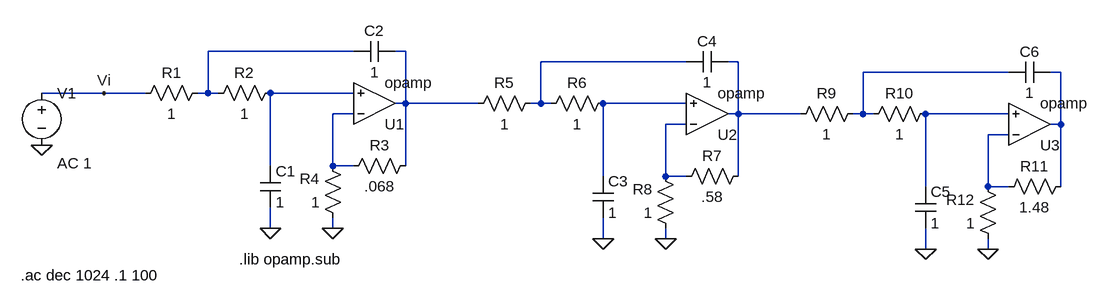
[diagram p0: schematic EJ3-TP2.asc]
EJ3-TP2.asc, the LTspice schematic file:
Version 4
SHEET 1 1192 680
WIRE 96 16 -128 16
WIRE 176 16 160 16
WIRE 608 32 384 32
WIRE 688 32 672 32
WIRE 1104 48 880 48
WIRE 1184 48 1168 48
WIRE -288 80 -384 80
WIRE -224 80 -288 80
WIRE -128 80 -128 16
WIRE -128 80 -144 80
WIRE -112 80 -128 80
WIRE 96 80 -32 80
WIRE 176 96 176 16
WIRE 176 96 160 96
WIRE 288 96 176 96
WIRE 384 96 384 32
WIRE 384 96 368 96
WIRE 400 96 384 96
WIRE 608 96 480 96
WIRE 96 112 64 112
WIRE 688 112 688 32
WIRE 688 112 672 112
WIRE 784 112 688 112
WIRE 880 112 880 48
WIRE 880 112 864 112
WIRE 896 112 880 112
WIRE 1104 112 976 112
WIRE 608 128 576 128
WIRE 1184 128 1184 48
WIRE 1184 128 1168 128
WIRE 1104 144 1072 144
WIRE -32 192 -32 80
WIRE 64 192 64 112
WIRE 96 192 64 192
WIRE 176 192 176 96
WIRE 480 208 480 96
WIRE 576 208 576 128
WIRE 608 208 576 208
WIRE 688 208 688 112
WIRE 976 224 976 112
WIRE 1072 224 1072 144
WIRE 1104 224 1072 224
WIRE 1184 224 1184 128
WIRE -32 288 -32 256
WIRE 64 288 64 272
WIRE 480 304 480 272
WIRE 576 304 576 288
WIRE 976 320 976 288
WIRE 1072 320 1072 304
FLAG -32 288 0
FLAG 64 288 0
FLAG 480 304 0
FLAG 576 304 0
FLAG 976 320 0
FLAG 1072 320 0
FLAG -384 160 0
FLAG -288 80 Vi
SYMBOL OpAmps\\opamp 128 160 M180
SYMATTR InstName U1
SYMATTR SpiceLine Aol=1000K
SYMATTR SpiceLine2 GBW=1000Meg
SYMBOL res -128 64 R90
WINDOW 0 0 56 VBottom 2
WINDOW 3 32 56 VTop 2
SYMATTR InstName R1
SYMATTR Value 1
SYMBOL res -16 64 R90
WINDOW 0 0 56 VBottom 2
WINDOW 3 32 56 VTop 2
SYMATTR InstName R2
SYMATTR Value 1
SYMBOL res 192 176 R90
WINDOW 0 0 56 VBottom 2
WINDOW 3 32 56 VTop 2
SYMATTR InstName R3
SYMATTR Value .068
SYMBOL res 80 288 R180
WINDOW 0 36 76 Left 2
WINDOW 3 36 40 Left 2
SYMATTR InstName R4
SYMATTR Value 1
SYMBOL cap -48 192 R0
SYMATTR InstName C1
SYMATTR Value 1
SYMBOL cap 160 0 R90
WINDOW 0 0 32 VBottom 2
WINDOW 3 32 32 VTop 2
SYMATTR InstName C2
SYMATTR Value 1
SYMBOL OpAmps\\opamp 640 176 M180
SYMATTR InstName U2
SYMBOL res 384 80 R90
WINDOW 0 0 56 VBottom 2
WINDOW 3 32 56 VTop 2
SYMATTR InstName R5
SYMATTR Value 1
SYMBOL res 496 80 R90
WINDOW 0 0 56 VBottom 2
WINDOW 3 32 56 VTop 2
SYMATTR InstName R6
SYMATTR Value 1
SYMBOL res 704 192 R90
WINDOW 0 0 56 VBottom 2
WINDOW 3 32 56 VTop 2
SYMATTR InstName R7
SYMATTR Value .58
SYMBOL res 592 304 R180
WINDOW 0 36 76 Left 2
WINDOW 3 36 40 Left 2
SYMATTR InstName R8
SYMATTR Value 1
SYMBOL cap 464 208 R0
SYMATTR InstName C3
SYMATTR Value 1
SYMBOL cap 672 16 R90
WINDOW 0 0 32 VBottom 2
WINDOW 3 32 32 VTop 2
SYMATTR InstName C4
SYMATTR Value 1
SYMBOL OpAmps\\opamp 1136 192 M180
SYMATTR InstName U3
SYMBOL res 880 96 R90
WINDOW 0 0 56 VBottom 2
WINDOW 3 32 56 VTop 2
SYMATTR InstName R9
SYMATTR Value 1
SYMBOL res 992 96 R90
WINDOW 0 0 56 VBottom 2
WINDOW 3 32 56 VTop 2
SYMATTR InstName R10
SYMATTR Value 1
SYMBOL res 1200 208 R90
WINDOW 0 0 56 VBottom 2
WINDOW 3 32 56 VTop 2
SYMATTR InstName R11
SYMATTR Value 1.48
SYMBOL res 1088 320 R180
WINDOW 0 36 76 Left 2
WINDOW 3 36 40 Left 2
SYMATTR InstName R12
SYMATTR Value 1
SYMBOL cap 960 224 R0
SYMATTR InstName C5
SYMATTR Value 1
SYMBOL cap 1168 32 R90
WINDOW 0 0 32 VBottom 2
WINDOW 3 32 32 VTop 2
SYMATTR InstName C6
SYMATTR Value 1
SYMBOL voltage -384 64 R0
WINDOW 123 24 124 Left 2
WINDOW 39 0 0 Left 0
SYMATTR Value2 AC 1
SYMATTR InstName V1
SYMATTR Value ""
TEXT -80 336 Left 2 !.lib opamp.sub
TEXT -416 360 Left 2 !.ac dec 1024 .1 100

The netlist it stands for:
* EJ3-TP2.asc
XU1 N009 N007 N002 opamp Aol=1000K GBW=1000Meg  ; pins invin noninvin out
R1 N001 Vi 1
R2 N007 N001 1
R3 N002 N009 .068
R4 0 N009 1
C1 N007 0 1
C2 N002 N001 1
XU2 N011 N008 N004 opamp Aol=100K GBW=10Meg  ; pins invin noninvin out
R5 N003 N002 1
R6 N008 N003 1
R7 N004 N011 .58
R8 0 N011 1
C3 N008 0 1
C4 N004 N003 1
XU3 N012 N010 N006 opamp Aol=100K GBW=10Meg  ; pins invin noninvin out
R9 N005 N004 1
R10 N010 N005 1
R11 N006 N012 1.48
R12 0 N012 1
C5 N010 0 1
C6 N006 N005 1
V1 Vi 0 AC 1
.lib opamp.sub
.ac dec 1024 .1 100
.backanno
.end